# EAGLE schematic SatNOGS_PSU (EAGLE 7.1.0)
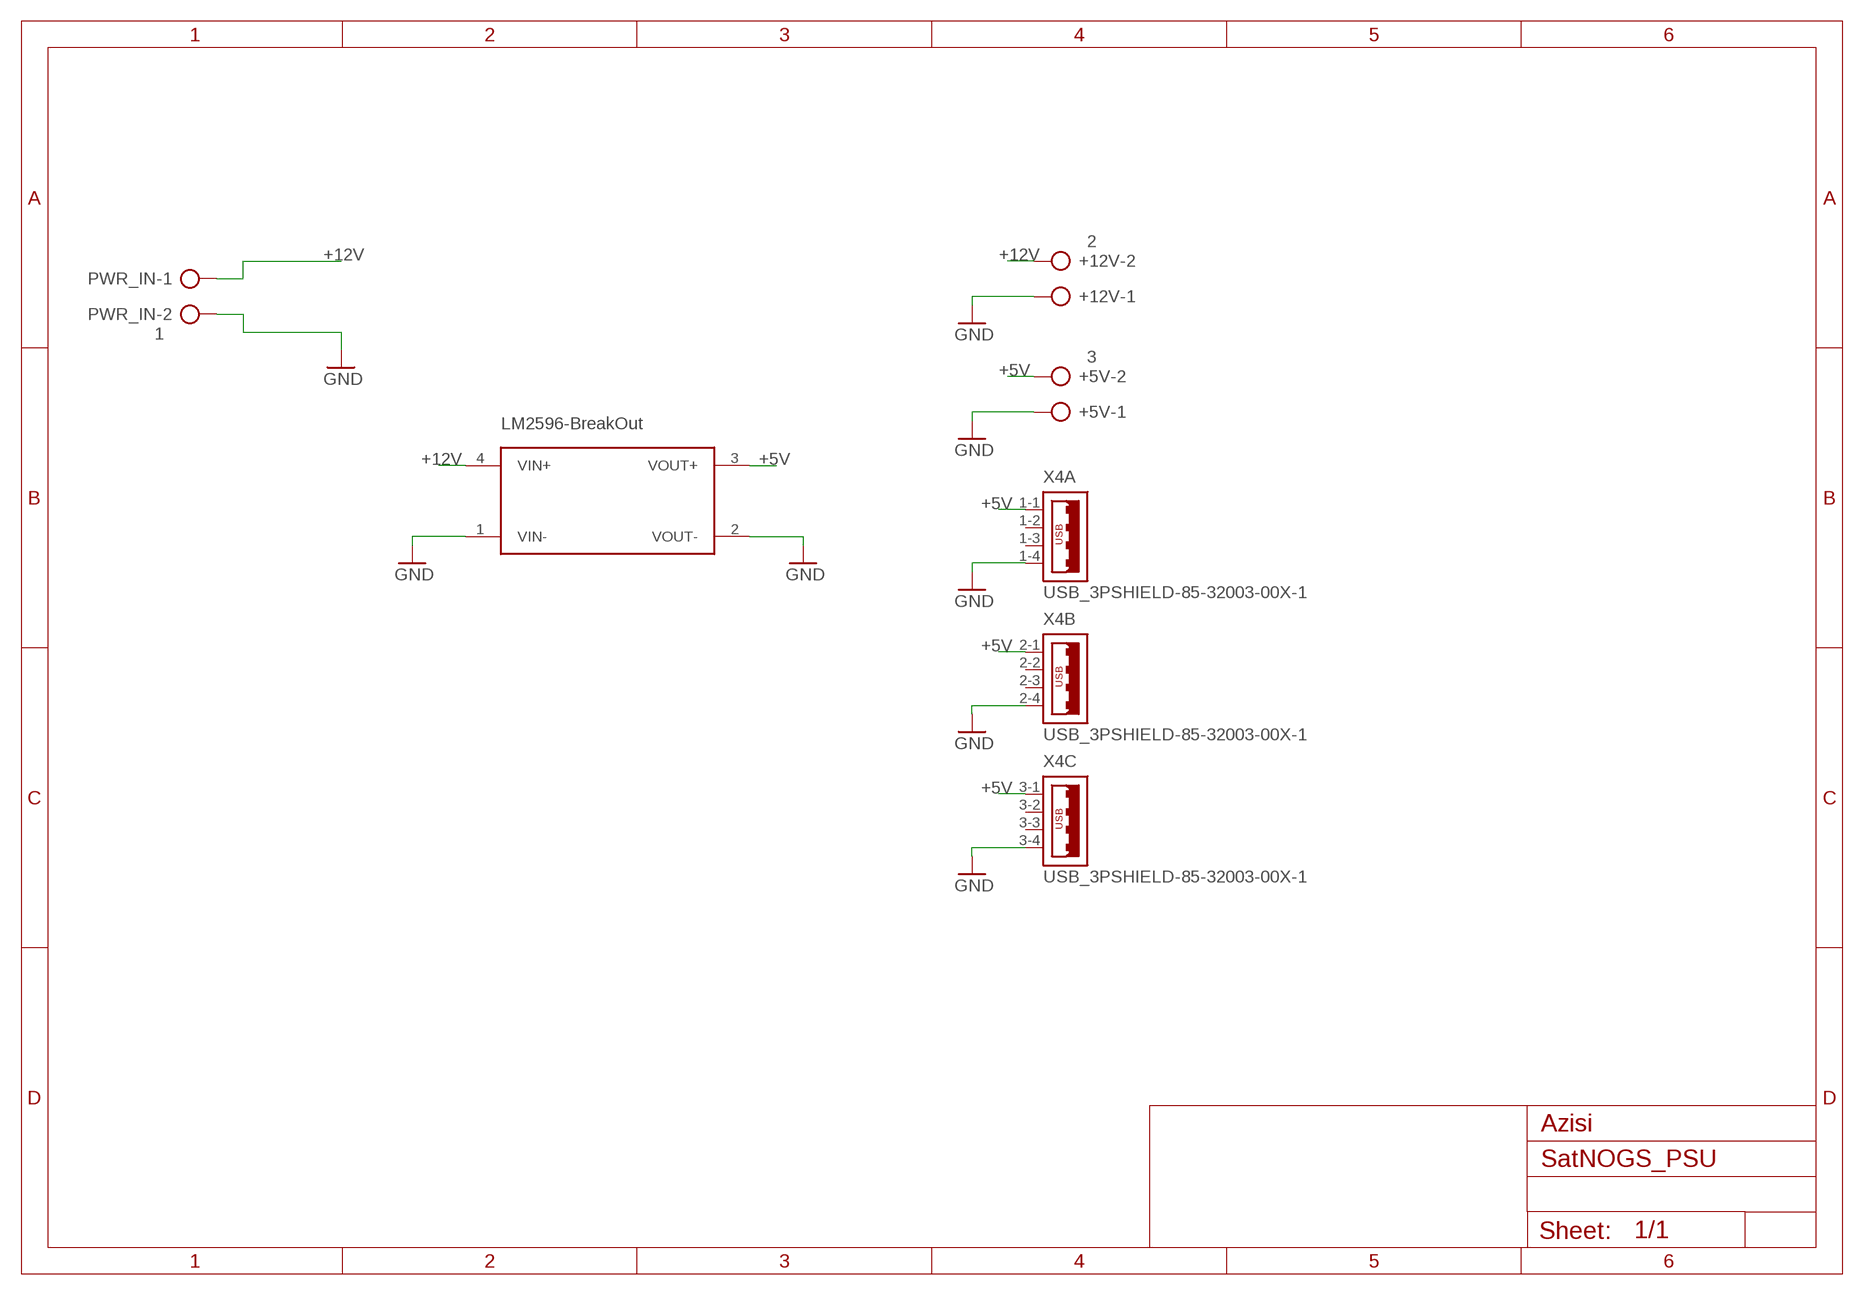
[diagram p0: schematic, sheet 1]

## Parts
+5V  3  AK500/2  [AK500/2]
+12V  2  AK500/2  [AK500/2]
PWR_IN  1  AK500/2  [AK500/2]
U$1  LM2596-BREAKOUTLM2596-BREAKOUT  [LM2596-BREAKOUT]
X4  USB_3PSHIELD-85-32003-00X-1  [85-32003-00X-1]

## Nets
+5V: +5V.2 U$1.3(VOUT+) X4.1-1 X4.2-1 X4.3-1
+12V: +12V.2 PWR_IN.1 U$1.4(VIN+)
GND: +5V.1 +12V.1 PWR_IN.2 U$1.1(VIN-) U$1.2(VOUT-) X4.1-4 X4.2-4 X4.3-4
Unconnected: X4.1-2 X4.1-3 X4.2-2 X4.2-3 X4.3-2 X4.3-3 X4.M1(S:S1) X4.M2(S:S2) X4.M3(S:S3) X4.M4(S:S4)

## Notes on the sheet
- Azisi

## Library data of the parts
+5V +12V PWR_IN = con-ptr500:AK500/2: CONNECTOR; OC_FARNELL: unknown; OC_NEWARK: unknown
U$1 = LM2596-Breakout:LM2596-BREAKOUT: Break out for LM2596 Switching power supply (regulated)
X4 = con-cypressindustries:USB_3PSHIELD-: Triple USB Connector Source: www.cypressindustries.com; OC_FARNELL: unknown; OC_NEWARK: unknown